# Altium schematic sheet Connections.SchDoc
size A; SheetNumber: 3; SheetTotal: 5
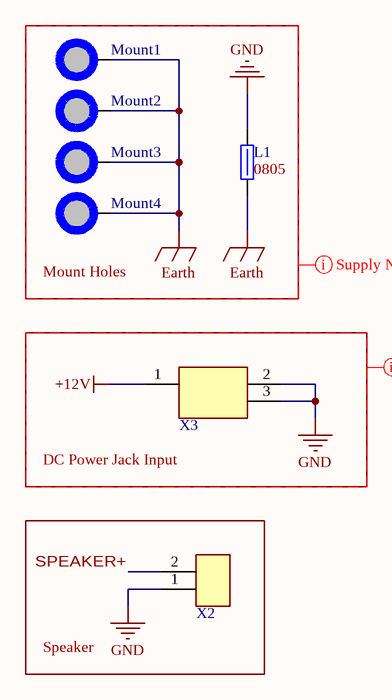
[diagram p0: Connections.SchDoc]

## Parts
L1  Size Package: 0805  [[Ferrite] SMD 0805]  (hidden comment: 652-MH2029-300Y)
Mount1  M3 Mount Hole  [[Mount] M3 Mount Hole]  (value not drawn)  (no BOM)
Mount2  M3 Mount Hole  [[Mount] M3 Mount Hole]  (value not drawn)  (no BOM)
Mount3  M3 Mount Hole  [[Mount] M3 Mount Hole]  (value not drawn)  (no BOM)
Mount4  M3 Mount Hole  [[Mount] M3 Mount Hole]  (value not drawn)  (no BOM)
X2  2pin Screw Terminal  [[Screw Terminal] 2pin 5mm]  (value not drawn)
X3  [Barrel] DC Jack 2mmID  [[Barrel] DC Jack]  (value not drawn)

## Blocks framed on the sheet
Mount Holes: L1 Mount1-Mount4
DC Power Jack Input: X3
Speaker: X2

## Nets
+12V: X3.1(Pin)
Earth: L1.1 Mount1.1 Mount2.1 Mount3.1 Mount4.1
GND: L1.2 X2.1 X3.2(Barrel) X3.3(Barrel)
SPEAKER+: X2.2

## Layout directives
net class Supply_Nets: +12V, Earth, GND

## Library data of the parts
L1 = [Ferrite] SMD 0805 3A 30ohm: Res @ Freq: 30 @ 100MHz; Supplier 1: DigiKey; Supplier Part Number 1: MH2029-300YCT-ND
Mount1-Mount4 = [Mount] M3 Mount Hole: Place at least 4.5mm from board edge. Plated.
X2 = [Screw Terminal] 2pin: TB002-500-02BE; Supplier 1: DigiKey; Supplier Part Number 1: 102-6145-ND
X3 = [Barrel] DC Jack 2mmID: PJ-102A; Supplier 1: DigiKey; Supplier Part Number 1: CP-102A-ND